# EAGLE design gateway_V2 (EAGLE 9.2.0)
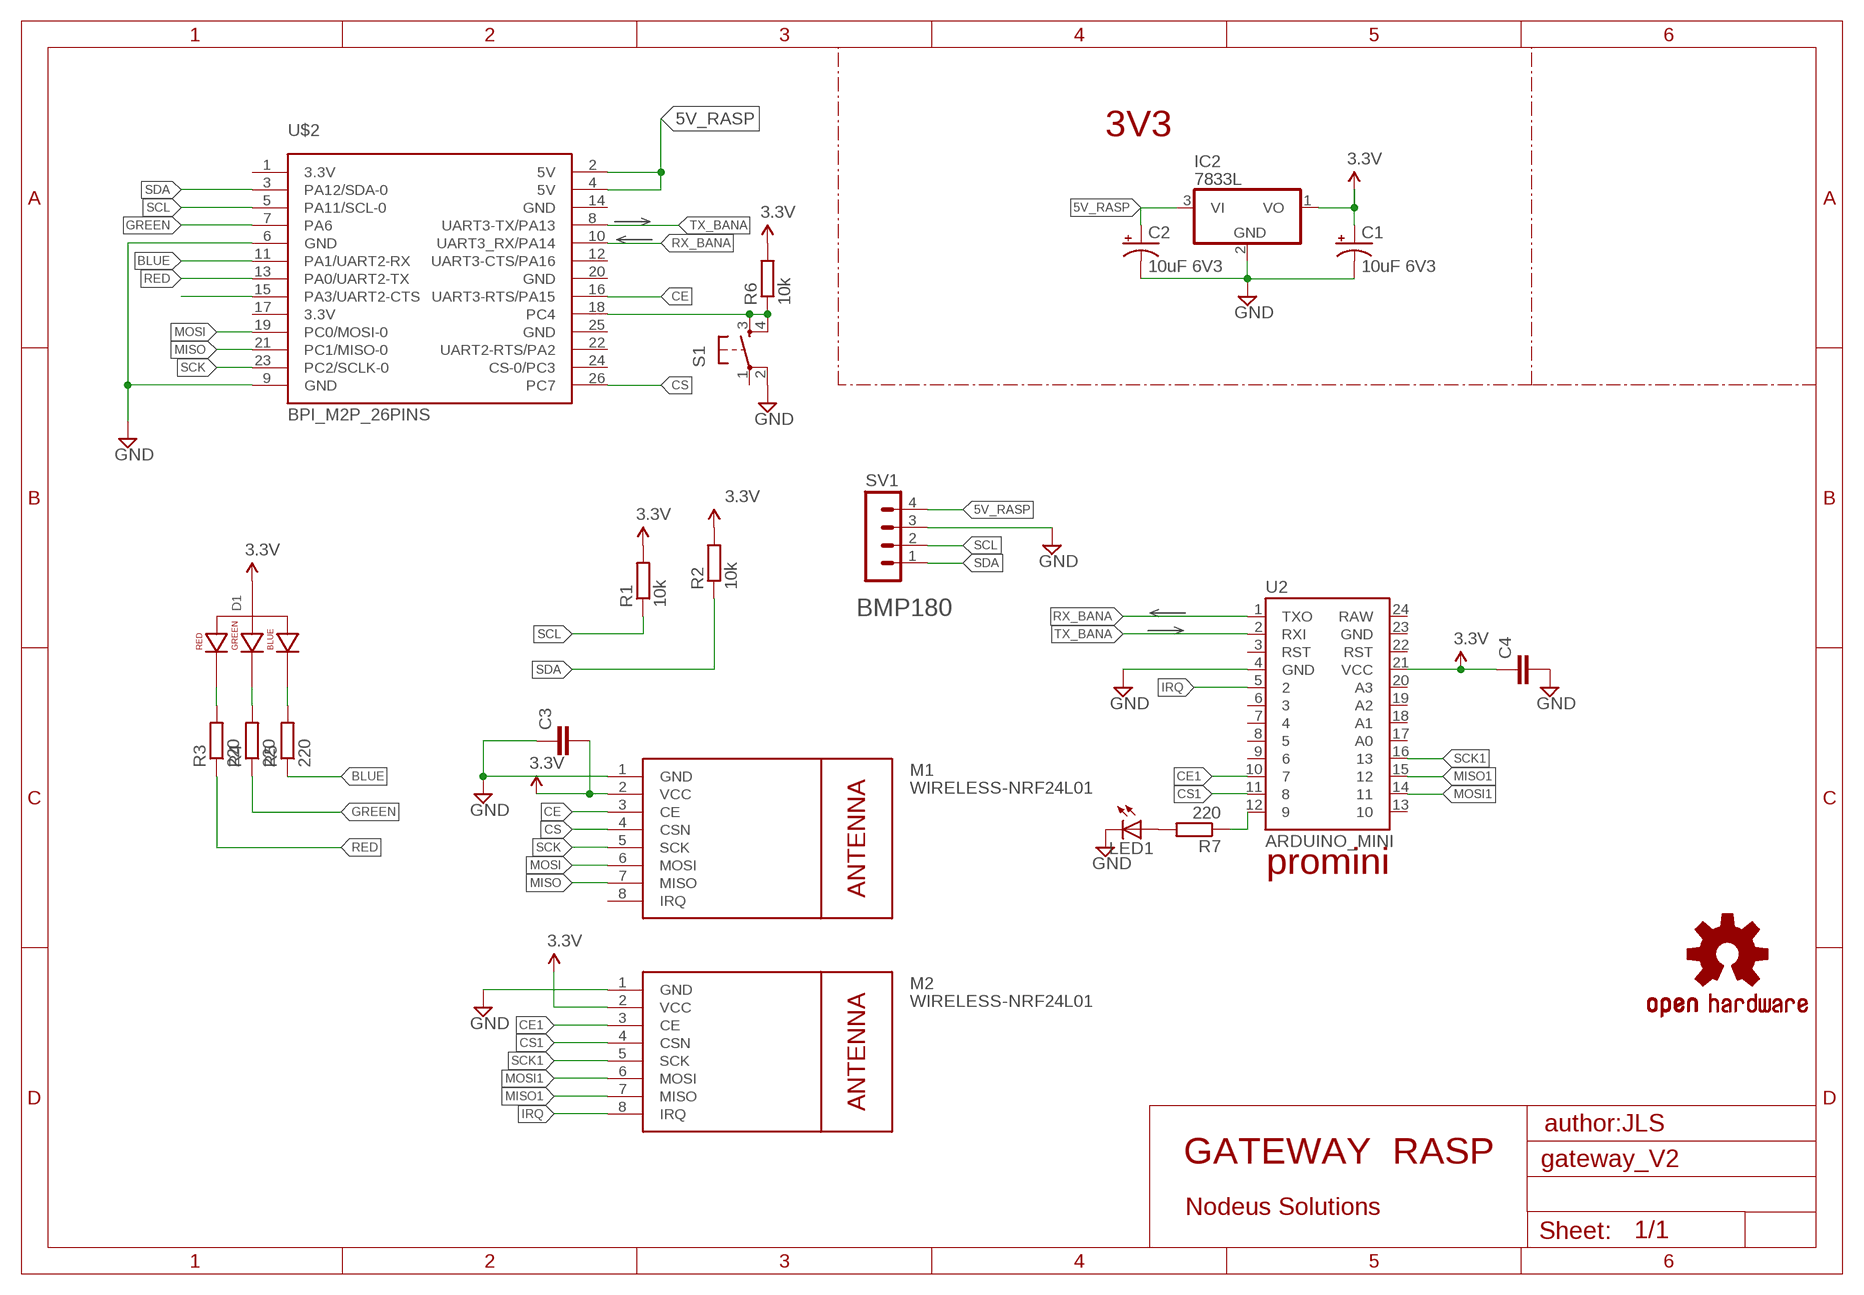
[diagram p0: schematic, sheet 1]

## Parts
C1  10uF 6V3  CAP_POLPTH1  [CPOL-RADIAL-100UF-25V]
C2  10uF 6V3  CAP_POLPTH1  [CPOL-RADIAL-100UF-25V]
C3  C050-035X075  [C050-035X075]
C4  C050-035X075  [C050-035X075]
D1  LED-RGB-CA-THRUCLEAR  [LED-RGB-THRU]
IC2  7833L  [TO92L]
LED1  LED3MM  [LED3MM]
LOGO1  OSHW-LOGOMINI  [OSHW-LOGO-MINI]
M1  WIRELESS-NRF24L01  [WIRELESS-NRF24L01]
M2  WIRELESS-NRF24L01  [WIRELESS-NRF24L01]
R1  10k  R0207/10  [0207/10]
R2  10k  R0207/10  [0207/10]
R3  220  R0207/10  [0207/10]
R4  220  R0207/10  [0207/10]
R5  220  R0207/10  [0207/10]
R6  10k  R0207/10  [0207/10]
R7  220  R0207/10  [0207/10]
S1  PUSH_BUTTONPTH  [TACTILE-PTH]
SV1  CON_HE14-4P  [MA04-1]
U2  ARDUINO_MINI  [ARDUINO_MINI]
U$2  BPI_M2P_26PINS  [13X2-PTH]

## Nets
5V_RASP: C2.1(+) IC2.3(VI) SV1.4 U$2.2(5V) U$2.4(5V)
BLUE: R5.1 U$2.11(PA1/UART2-RX)
CE: M1.3(CE) U$2.16(UART3-RTS/PA15)
CE1: M2.3(CE) U2.10
CS: M1.4(CSN) U$2.26(PC7)
CS1: M2.4(CSN) U2.11
GND [power]: C1.2(-) C2.2(-) C3.1 C4.2 IC2.2(GND) LED1.K(C) M1.1(GND) M2.1(GND) S1.2 SV1.3 U2.4(GND) U$2.6(GND) U$2.9(GND)
GREEN: R4.1 U$2.7(PA6)
IRQ: M2.8(IRQ) U2.5
MISO: M1.7(MISO) U$2.21(PC1/MISO-0)
MISO1: M2.7(MISO) U2.15
MOSI: M1.6(MOSI) U$2.19(PC0/MOSI-0)
MOSI1: M2.6(MOSI) U2.14
N$1: R6.1 S1.3 S1.4 U$2.18(PC4)
N$2: R7.1 U2.12
N$3: LED1.A R7.2
N$4: U$2.15(PA3/UART2-CTS)
N$5: D1.1(RED_CATHODE) R3.2
N$6: D1.3(GREEN_CATHODE) R4.2
N$8: D1.4(BLUE_CATHODE) R5.2
RED: R3.1 U$2.13(PA0/UART2-TX)
RX_BANA: U2.1(TXO) U$2.10(UART3_RX/PA14)
SCK: M1.5(SCK) U$2.23(PC2/SCLK-0)
SCK1: M2.5(SCK) U2.16
SCL: R1.1 SV1.2 U$2.5(PA11/SCL-0)
SDA: R2.1 SV1.1 U$2.3(PA12/SDA-0)
TX_BANA: U2.2(RXI) U$2.8(UART3-TX/PA13)
VCC [power]: C1.1(+) C3.2 C4.1 D1.2(ANODE) IC2.1(VO) M1.2(VCC) M2.2(VCC) R1.2 R2.2 R6.2 U2.21(VCC) ; supply symbol labelled 3.3V
Unconnected: M1.8(IRQ) S1.1 U2.3(RST) U2.6 U2.7 U2.8 U2.9 U2.13 U2.17(A0) U2.18(A1) U2.19(A2) U2.20(A3) U2.22(RST) U2.23(GND) U2.24(RAW) U$2.12(UART3-CTS/PA16) U$2.14(GND) U$2.22(UART2-RTS/PA2) U$2.24(CS-0/PC3)

## Notes on the sheet
- 3V3
- BMP180
- promini
- author:JLS
- GATEWAY  RASP
- Nodeus Solutions

## Power pins joined to a net without a drawn wire
3.3V: U$2.1(3.3V) U$2.17(3.3V)
GND: U$2.20(GND) U$2.25(GND)

## Library data of the parts
C1 C2 = SparkFun-Passives:CAP_POL: Capacitor Polarized These are standard SMD and PTH capacitors. Normally 10uF, 47uF, and 100uF in electrolytic and tantalum varieties. Always verify the external diameter of the through hole cap, it varies with capacity, voltage, and manufacturer. The EIA devices should be standard.
C3 C4 = IUTV3:C: Capacitor Standard 0603 ceramic capacitor, and 0.1" leaded capacitor.
D1 = SparkFun-LED:LED-RGB-CA-THRU: RGB Through-hole common anode SparkFun store front COM-10821 (diffuse) COM-10820 (clear); PROD_ID: DIO-10631
IC2 = IUTV3:78*: Positive VOLTAGE REGULATOR Source: http://cache.national.com/ds/LM/LM78L05.pdf http://www.fairchildsemi.com/ds/LM/LM7805.pdf
LED1 = adafruit:LED: LED OSRAM: - CHIPLED LG R971, LG N971, LY N971, LG Q971, LY Q971, LO R971, LY R971 LH N974, LH R974 LS Q976, LO Q976, LY Q976 LO Q996 - Hyper CHIPLED LW Q18S LB Q993, LB Q99A, LB R99A - SideLED LS A670, LO A670, LY A670, LG A670, LP A670 LB A673, LV A673, LT A673, LW A673 LH A674 LY A675 LS A676, LA A676, LO A676, LY A676, LW A676 LS A679, LY A679, LG A679 - Hyper Micro SIDELED® LS Y876, LA Y876, LO Y876, LY Y876 LT Y87S - SmartLED LW L88C, LW L88S LB L89C, LB L89S, LG L890 LS L89K, LO L89K, LY L89K LS L896, LA L896, LO L896, LY L896 - TOPLED LS T670, LO T670, LY T670, LG T670, LP T670 LSG T670, LSP T670, LSY T670, LOP T670, LYG T670 LG T671, LOG T671, LSG T671 LB T673, LV T673, LT T673, LW T673 LH T674 LS T676, LA T676, LO T676, LY T676, LB T676, LH T676, LSB T676, LW T676 LB T67C, LV T67C, LT T67C, LS T67K, LO T67K, LY T67K, LW E67C LS E67B, LA E67B, LO E67B, LY E67B, LB E67C, LV E67C, LT E67C LW T67C LS T679, LY T679, LG T679 LS T770, LO T770, LY T770, LG T770, LP T770 LB T773, LV T773, LT T773, LW T773 LH T774 LS E675, LA E675, LY E675, LS T675 LS T776, LA T776, LO T776, LY T776, LB T776 LHGB T686 LT T68C, LB T68C - Hyper Mini TOPLED® LB M676 - Mini TOPLED Santana® LG M470 LS M47K, LO M47K, LY M47K Source: http://www.osram.convergy.de/
LOGO1 = SparkFun-Aesthetics:OSHW-LOGO: Open Source Hardware Logo This logo indicates the piece of hardware it is found on incorporates a OSHW license and/or adheres to the definition of open source hardware found here: http://freedomdefined.org/OSHW
M1 M2 = IUTV3:WIRELESS-NRF24L01: 2.4 GHz Wireless Module based on NRF24L01 chip
R1-R7 = IUTV3:R: Résistance, Série MCF, 250 mW, ± 5%
S1 = IUTV3:PUSH_BUTTON: Momentary Switch Button commonly used for reset or general input. Spark Fun Electronics SKU : COM-00097 SMT- SWCH-08247; OC_FARNELL: 1555981
SV1 = IUTV3:CON_HE14-4P: PIN HEADER; MF: HARWIN; MOT_CLES_FARNELL: Connecteur carte-à-carte, Straight, Série M20 2.54 mm; MOT_CLES_RADIOSPARE: Embases de circuit imprimé,1 rangée; MPN: M20-9990446; OC_FARNELL: 1022251
U2 = SparkFun-Boards:ARDUINO_MINI: Arduino Pro Mini footprint
U$2 = GeekAmmo:BPI_M2P_26PINS: Raspberry Pi IO connector

## Net classes
1 power: width 0.508 mm, clearance 0.205 mm to class 0, clearance 0.254 mm

## Board
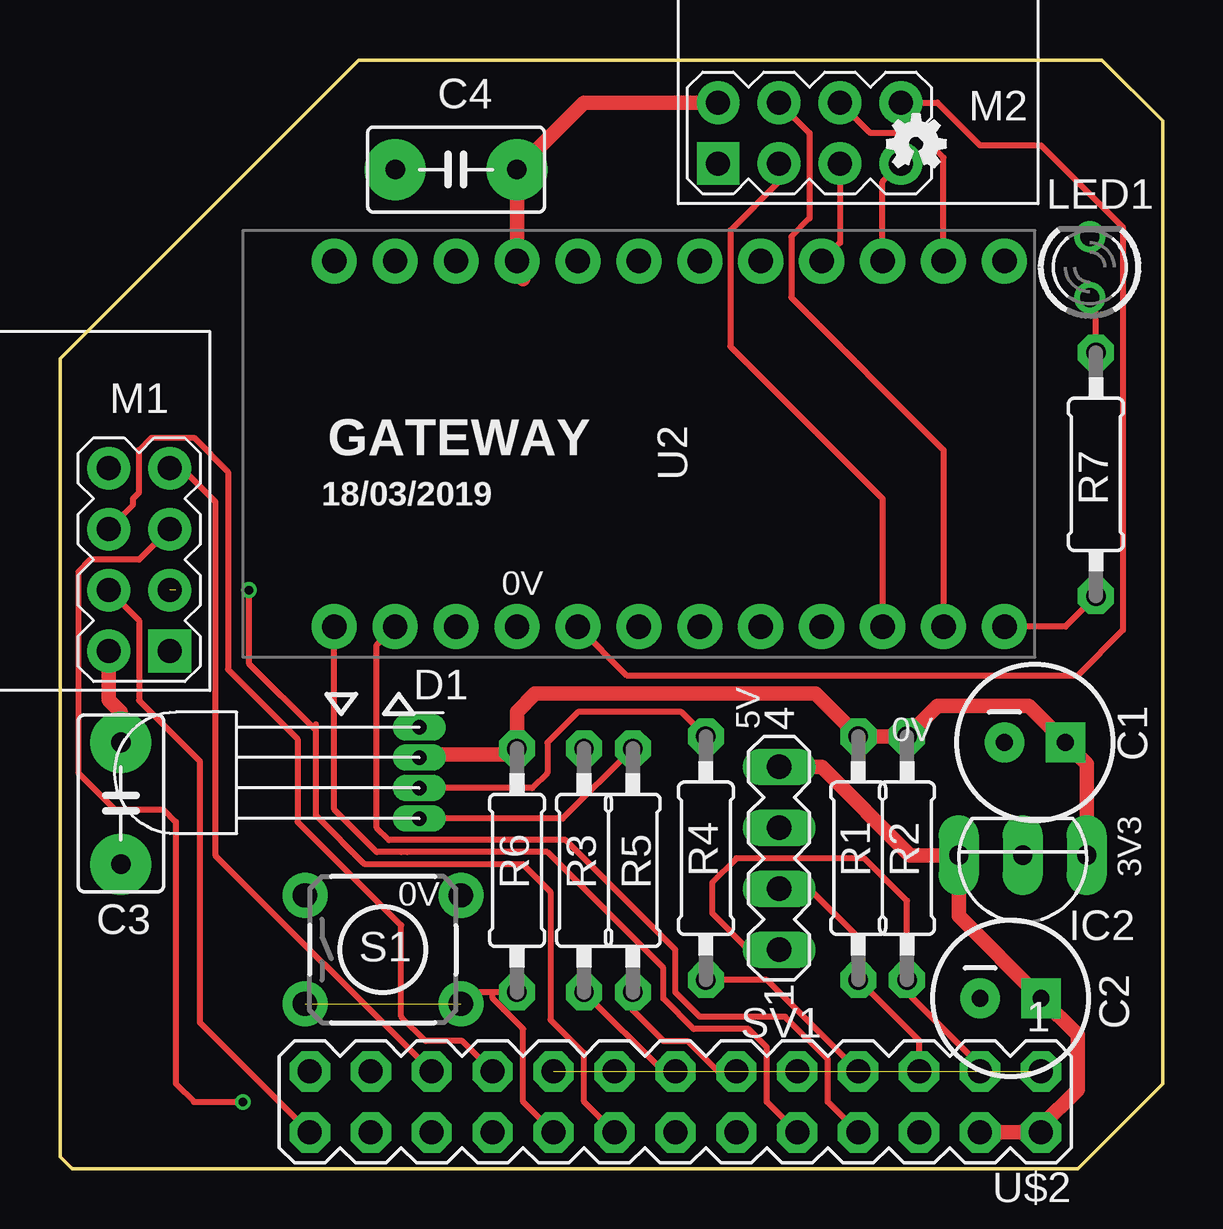
[diagram p1: board, top side]
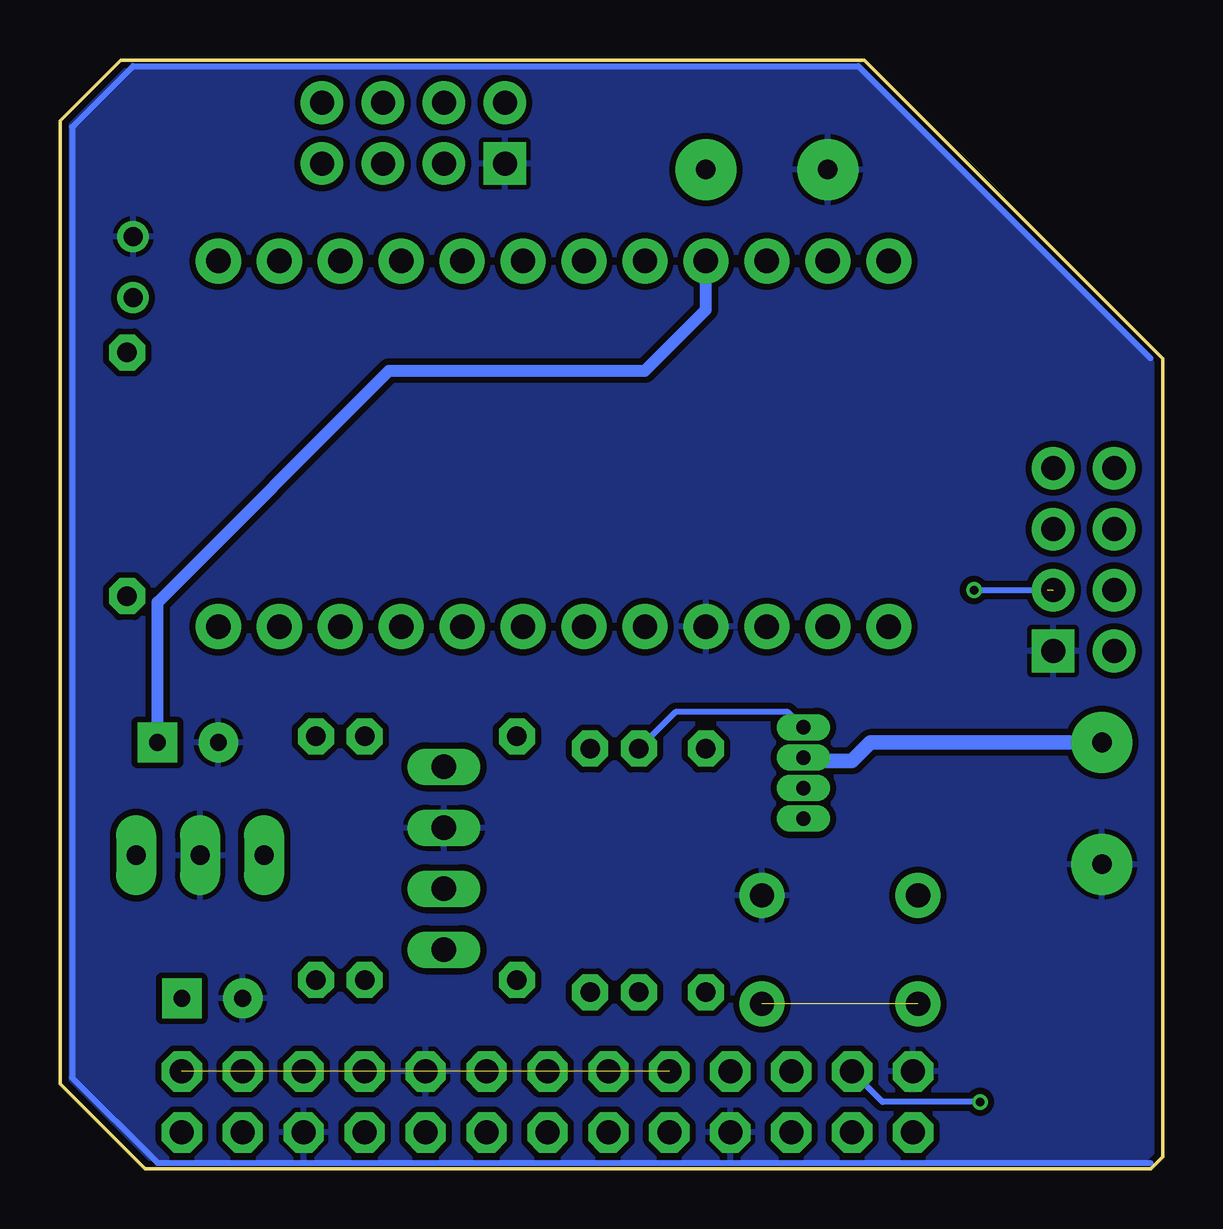
[diagram p2: board, bottom side, seen from below]

Size 45.97 x 46.23 mm. Coordinates in mm from the lower left corner, seen from the top.
Outline: 42.42,0 0.51,0 0,0.51 0,33.78 12.45,46.23 43.43,46.23 45.97,43.69 45.97,3.56 42.42,0
Copper layers (1*16): Top 0.035mm / dielectric 1.5mm / Bottom 0.035mm
Design rules "ITEADstudio_DRC *": minimum track width 6mil, minimum drill 12mil, track to track 10mil, track to pad 10mil, pad to pad 10mil, via to via 10mil, smd to smd 0mil, copper to edge 10mil, drill to drill 10mil, minimum pad ring 10mil, minimum via ring 6mil, stop-mask expansion 2mil, vias tented up to drill 100mil, thermal gap 0.2mm

### Footprints (pad centres in the part's own frame; a part is rotated, then mirrored left to right if it is on the bottom)
CPOL-RADIAL-100UF-25V = drill 0.7 pad 1.651 square: 1 1.27,0 | drill 0.7 pad 1.651: 2 -1.27,0
C050-035X075 = drill 0.813 pad 2.54: 1 -2.54,0; 2 2.54,0
LED-RGB-THRU = drill 0.6 pad 0.8 long: 1 1.905,0; 2 0.635,0; 3 -0.635,0; 4 -1.905,0
TO92L = drill 0.8 pad 1.676 long: 1 -1.397,-0.127; 2 1.27,-0.127; 3 3.937,-0.127
LED3MM = drill 0.8: A -1.27,0; K 1.27,0
WIRELESS-NRF24L01 = drill 1 pad 1.778 square: 1 -12.7,6.35 | drill 1 pad 1.778: 2 -10.16,6.35; 3 -12.7,3.81; 4 -10.16,3.81; 5 -12.7,1.27; 6 -10.16,1.27; 7 -12.7,-1.27; 8 -10.16,-1.27
0207/10 = drill 0.81 pad 1.5 octagon: 1 -5.08,0; 2 5.08,0
TACTILE-PTH = drill 1.016 pad 1.88: 1 -3.251,2.261; 2 3.251,2.261; 3 -3.251,-2.261; 4 3.251,-2.261
MA04-1 = drill 1.016 long: 1 -3.81,0; 2 -1.27,0; 3 1.27,0; 4 3.81,0
ARDUINO_MINI = drill 1.016 pad 1.88: 1 -7.62,12.7; 2 -7.62,10.16; 3 -7.62,7.62; 4 -7.62,5.08; 5 -7.62,2.54; 6 -7.62,0; 7 -7.62,-2.54; 8 -7.62,-5.08; 9 -7.62,-7.62; 10 -7.62,-10.16; 11 -7.62,-12.7; 12 -7.62,-15.24; 13 7.62,-15.24; 14 7.62,-12.7; 15 7.62,-10.16; 16 7.62,-7.62; 17 7.62,-5.08; 18 7.62,-2.54; 19 7.62,0; 20 7.62,2.54; 21 7.62,5.08; 22 7.62,7.62; 23 7.62,10.16; 24 7.62,12.7
13X2-PTH = drill 1 pad 1.676 octagon: 1 -15.24,-1.27; 2 -15.24,1.27; 3 -12.7,-1.27; 4 -12.7,1.27; 5 -10.16,-1.27; 6 -10.16,1.27; 7 -7.62,-1.27; 8 -7.62,1.27; 9 -5.08,-1.27; 10 -5.08,1.27; 11 -2.54,-1.27; 12 -2.54,1.27; 13 0,-1.27; 14 0,1.27; 15 2.54,-1.27; 16 2.54,1.27; 17 5.08,-1.27; 18 5.08,1.27; 19 7.62,-1.27; 20 7.62,1.27; 21 10.16,-1.27; 22 10.16,1.27; 23 12.7,-1.27; 24 12.7,1.27; 25 15.24,-1.27; 26 15.24,1.27

### Placement (x,y rotation side)
C1  40.64,17.78 0 top
C2  39.62,7.11 0 top
C3  2.54,15.24 90 top
C4  16.51,41.66 180 top
D1  14.99,16.51 90 top
DRILEGEND  [DRILEGEND]  -17.12,-6.46 0 top  (outside the outline)
IC2  41.4,12.95 180 top
LED1  42.93,37.59 90 top
LOGO1  35.69,42.75 0 top
M1  -8.13,27.94 180 top
M2  33.78,54.61 90 top
R1  33.27,12.95 90 top
R2  35.31,12.95 90 top
R3  21.84,12.45 90 top
R4  26.92,12.95 90 top
R5  23.88,12.45 90 top
R6  19.05,12.45 90 top
R7  43.18,28.96 90 top
S1  13.46,9.14 0 top
SV1  29.97,12.95 90 top
U2  24.13,30.23 90 top
U$2  25.65,2.79 180 top

### Tracks (layer width: path | path; a pad name or v marks a point on that pad's centre or on a via)
3.3V  (1 unrouted)
5V_RASP
  Top 0.61: U$2.4 U$2.2 40.89,1.78 42.42,3.3 42.42,5.59 C2.1 37.47,10.54 IC2.3 35.43,13.08 31.75,16.76 SV1.4
BLUE
  Top 0.254: 24.13,7.37 R5.1 23.88,6.6 25.15,5.33 26.16,5.33 27.43,4.06 U$2.11 27.69,4.06
CE  (via drill 0.35)  (1 unrouted)
  Top 0.254: U$2.16 21.84,2.79 21.84,4.83 20.45,6.22 20.45,11.56 19.3,12.7 12.7,12.7 10.67,14.73 10.67,18.29 | 10.67,18.29 10.67,18.54 | 10.67,18.29 7.87,21.08 v7.87,24.13
  Bottom 0.254: v7.87,24.13 4.83,24.13
CE1
  Top 0.254: M2.3 29.97,41.15 27.94,39.12 27.94,34.29 34.29,27.94 U2.10
CS
  Top 0.254: U$2.26 5.84,6.1 5.84,17 3.3,19.54 3.3,22.86 M1.4
CS1
  Top 0.254: M2.4 31.24,43.18 31.24,39.62 30.48,38.86 30.48,36.32 36.83,29.97 U2.11
GND
  Bottom 0.254: 0.51,33.78 12.7,45.97 42.93,45.97 45.47,43.43 45.47,3.81 41.91,0.25 0.51,0.25
  pour Bottom: -0.76,-0.51 -1.27,0 -1.27,47.75 -1.02,48.01 43.43,48.01 46.99,44.45 46.99,2.03 44.45,-0.51
GREEN
  Top 0.254: U$2.7 29.46,7.87 R4.1
IRQ
  Top 0.254: M2.8 36.58,44.45 38.35,42.67 40.89,42.67 44.31,39.26 44.31,22.47 42.42,20.57 23.62,20.57 U2.5
MISO
  Top 0.254: U$2.21 6.48,13.08 6.48,27.81 5.08,29.21 M1.7
MISO1
  Top 0.254: M2.7 34.29,41.15 U2.15
MOSI
  Top 0.254: U$2.19 16.76,5.33 15.24,5.33 14.22,6.35 14.22,10.16 9.91,14.48 9.91,17.93 7.01,20.83 7.01,29.06 5.59,30.48 3.81,30.48 3.3,29.97 3.3,28.19 3.05,27.94 3.05,27.69 M1.6
MOSI1
  Top 0.254: U2.14 36.83,42.16 35.81,43.18 33.78,43.18 M2.6
N$1  (1 unrouted)
  Top 0.254: R6.1 18.03,7.37 | 18.03,7.37 17.2,7.37 S1.4 | U$2.18 19.3,2.79 19.3,5.84 18.03,7.11 18.03,7.37
N$2
  Top 0.254: R7.1 41.91,22.61 U2.12
N$3
  Top 0.254: R7.2 43.18,36.07 LED1.A
N$5
  Bottom 0.254: D1.1 15.62,19.05 20.32,19.05 R3.2
N$6
  Top 0.254: R4.2 25.91,19.05 21.59,19.05 20.32,17.78 20.32,16.51 19.69,15.88 D1.3
N$8
  Top 0.254: R5.2 20.95,14.61 D1.4
RED
  Top 0.254: U$2.13 25.15,4.06 R3.1
RX_BANA
  Top 0.254: U$2.10 29.46,2.79 29.46,5.08 28.7,5.84 26.42,5.84 25.15,7.11 25.15,8.38 20.32,13.21 14.48,13.21 14.22,13.21 13.21,13.21 11.43,14.99 U2.1
SCK  (via drill 0.35)
  Top 0.254: M1.5 3.3,25.4 1.27,25.4 0.76,24.89 0.76,16.51 2.29,14.99 4.32,14.99 4.83,14.48 4.83,3.56 5.59,2.79 v7.62,2.79
  Bottom 0.254: v7.62,2.79 11.68,2.79 U$2.23
SCK1
  Top 0.254: M2.5 32.51,38.61 U2.16
SCL
  Top 0.254: U$2.5 35.81,5.33 R1.1 33.27,9.65 31.24,11.68 SV1.2
SDA
  Top 0.254: U$2.3 38.35,4.32 35.31,7.37 R2.1 35.31,11.18 33.53,12.95 28.19,12.95 27.18,11.94 27.18,10.67 28.7,9.14 SV1.1
TX_BANA
  Top 0.254: U$2.8 32,2.79 32,4.57 30.23,6.35 26.67,6.35 25.65,7.37 25.65,9.14 21.08,13.72 13.72,13.72 13.21,14.22 13.21,21.84 U2.2
VCC
  Top 0.61: IC2.1 42.8,16.89 C1.1 40.39,19.3 36.58,19.3 R2.2 R1.2 31.5,19.81 19.81,19.81 19.05,19.05 R6.2 18.8,17.27 15.11,17.27 D1.2 | C3.2 2.54,19.05 2.03,19.56 M1.2 | M2.2 21.84,44.45 C4.1 U2.21 | U2.21 19.05,37.34 19.3,37.08 19.3,37.59 U2.21
  Bottom 0.508: C1.1 41.91,23.62 32.26,33.27 21.59,33.27 19.05,35.81 U2.21
  Bottom 0.61: C3.2 12.19,17.78 12.95,17.02 14.86,17.02 D1.2

### Text on the board
tPlace: GATEWAY | 18/03/2019 | 0V | 5V | 0V | 0V | 3V3
_tsilk: 3.3 | GND | A1 | GND | A3 | A7 | GND | SCL | SDA | ANT | DTR | ATMEGA / 328p | FLASH | D7 | D3 | 3.3 | A6 | GND | 3.3 | VIN | GND | GND | GND | GND
_bsilk: 3.3 | A1 | GND | A3 | GND | A7 | GND | SCL | SDA | DTR | ANT | D7 | D3 | 3.3 | A6 | GND | 3.3 | VIN | GND | GND | GND | GND
DrillLegend: LAYER-STACK
DrillLegend_01-16: 01-16
DrillLegend_01-20: 01-20